# EAGLE design trackduino mini uc530 (EAGLE 7.1.0)
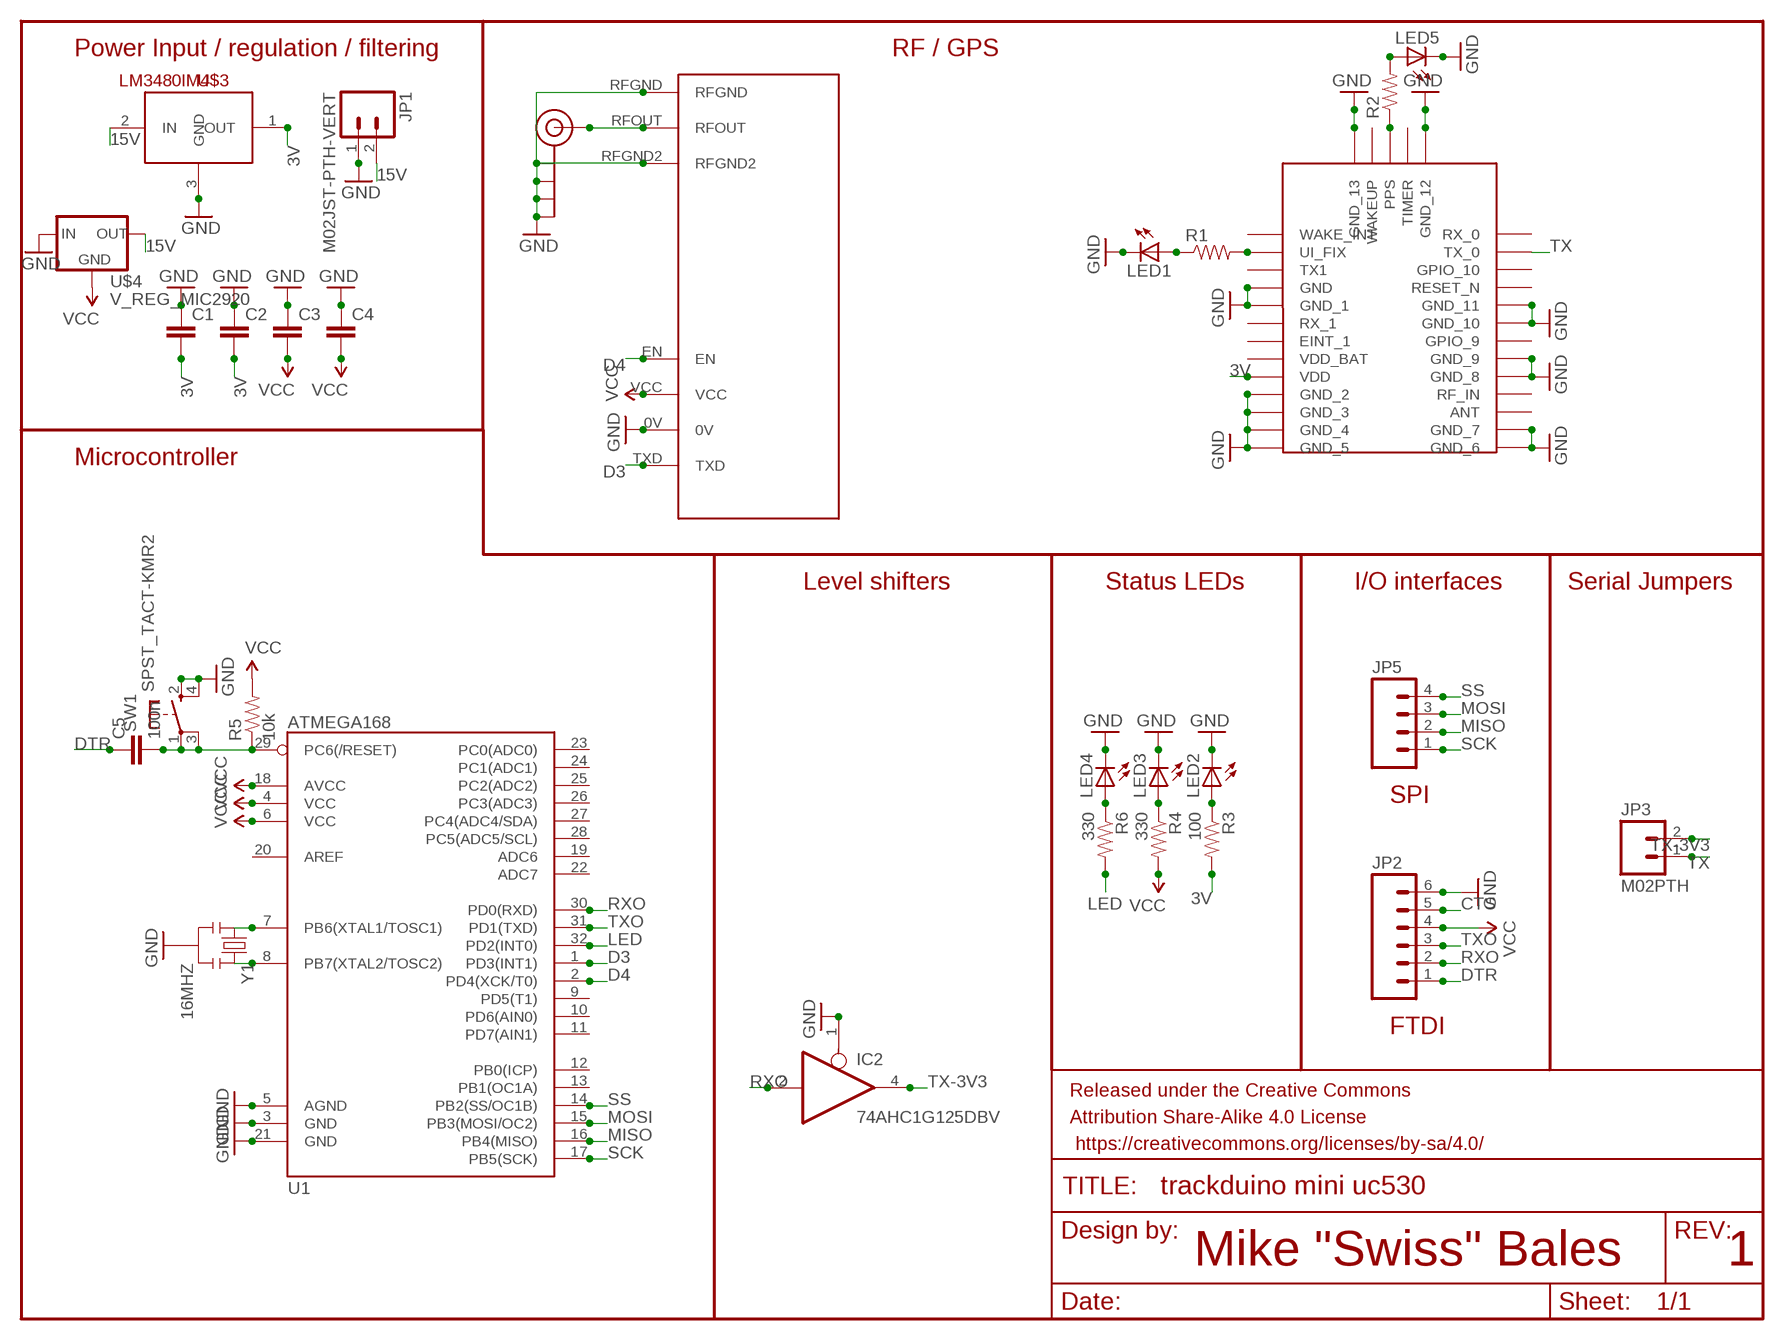
[diagram p0: schematic, sheet 1]

## Parts
C1  CAP0805  [0805]
C2  CAP0805  [0805]
C3  CAP0805  [0805]
C4  CAP0805  [0805]
C5  100n  CAP0805  [0805]
FRAME1  FRAME-LETTER  [CREATIVE_COMMONS]
IC2  74AHC1G125DBV  [SOT23-5]
J$1  SMA_EDGE  [SMA-EDGE]
JP1  M02JST-PTH-VERT  [JST-2-PTH-VERT]
JP2  M06NO_SILK_FEMALE_PTH  [1X06_NO_SILK]
JP3  M02PTH  [1X02]
JP5  M041X04_NO_SILK  [1X04_NO_SILK]
LED1  LEDCHIPLED_0805  [CHIPLED_0805]
LED2  LEDCHIP-LED0805  [CHIP-LED0805]
LED3  LEDCHIP-LED0805  [CHIP-LED0805]
LED4  LEDCHIP-LED0805  [CHIP-LED0805]
LED5  LEDCHIPLED_0805  [CHIPLED_0805]
R1  RESISTOR0805-RES  [0805]
R2  RESISTOR0805-RES  [0805]
R3  100  RESISTOR0805-RES  [0805]
R4  330  RESISTOR0805-RES  [0805]
R5  10k  RESISTOR0805-RES  [0805]
R6  330  RESISTOR0805-RES  [0805]
SW1  SPST_TACT-KMR2  [KMR2]
U1  ATMEGA168  [TQFP32-08]
U$1  UBLOXUC530  [UBLOXUC530]
U$2  RADIOMETRIX-HX1  [RADIOMETRIX-HX1]
U$3  LM3480IM4  [SOT23-3]
U$4  V_REG_MIC2920  [SOT223]
Y1  16MHZ  RESONATOR16MHZ  [RESONATOR-SMD]

## Nets
3V: C1.2 C2.2 R3.2 U$1.VDD U$3.1(OUT)
15V: JP1.2 U$3.2(IN) U$4.3(OUT)
CTS: JP2.5
D3: U1.1(PD3(INT1)) U$2.TXD
D4: U1.2(PD4(XCK/T0)) U$2.EN
DTR: C5.1 JP2.1
GND: C1.1 C2.1 C3.1 C4.1 IC2.1(OE) J$1.GND@0(GND) J$1.GND@1(GND) J$1.GND@2(GND) J$1.GND@3(GND) JP1.1 JP2.6 LED1.C LED2.C LED3.C LED4.C LED5.C SW1.2(S) SW1.4(S1) U1.3(GND) U1.5(AGND) U1.21(GND) U$1.GND U$1.GND_1 U$1.GND_2 U$1.GND_3 U$1.GND_4 U$1.GND_5 U$1.GND_6 U$1.GND_7 U$1.GND_8 U$1.GND_9 U$1.GND_10 U$1.GND_11 U$1.GND_12 U$1.GND_13 U$2.0V U$2.RFGND U$2.RFGND2 U$3.3(GND) U$4.1(IN) Y1.2
LED: R6.2 U1.32(PD2(INT0))
MISO: JP5.2 U1.16(PB4(MISO))
MOSI: JP5.3 U1.15(PB3(MOSI/OC2))
N$1: J$1.SIG(SIGNAL) U$2.RFOUT
N$7: LED2.A R3.1
N$8: LED3.A R4.1
N$9: C5.2 R5.1 SW1.1(P) SW1.3(P1) U1.29(PC6(/RESET))
N$14: U1.8(PB7(XTAL2/TOSC2)) Y1.3
N$26: U1.7(PB6(XTAL1/TOSC1)) Y1.1
N$27: LED4.A R6.1
N$33: R1.2 U$1.UI_FIX
N$34: R2.1 U$1.PPS
N$35: LED1.A R1.1
N$36: LED5.A R2.2
RXO: IC2.2(I) JP2.2 U1.30(PD0(RXD))
SCK: JP5.1 U1.17(PB5(SCK))
SS: JP5.4 U1.14(PB2(SS/OC1B))
TX: JP3.1 U$1.TX_0
TX-3V3: IC2.4(O) JP3.2
TXO: JP2.3 U1.31(PD1(TXD))
VCC: C3.2 C4.2 JP2.4 R4.2 R5.2 U1.4(VCC) U1.6(VCC) U1.18(AVCC) U$2.VCC U$4.2(GND)
Unconnected: U1.9(PD5(T1)) U1.10(PD6(AIN0)) U1.11(PD7(AIN1)) U1.12(PB0(ICP)) U1.13(PB1(OC1A)) U1.19(ADC6) U1.20(AREF) U1.22(ADC7) U1.23(PC0(ADC0)) U1.24(PC1(ADC1)) U1.25(PC2(ADC2)) U1.26(PC3(ADC3)) U1.27(PC4(ADC4/SDA)) U1.28(PC5(ADC5/SCL)) U$1.EINT_1 U$1.GPIO_9 U$1.GPIO_10 U$1.PANT(ANT) U$1.RESET_N U$1.RF_IN U$1.RX_0 U$1.RX_1 U$1.TIMER U$1.TX1 U$1.VDD_BAT U$1.WAKE_INT U$1.WAKEUP

## Notes on the sheet
- Power Input / regulation / filtering | RF / GPS
- Microcontroller
- Level shifters | Status LEDs | I/O interfaces | Serial Jumpers
- SPI
- FTDI
- Mike "Swiss" Bales | 1

## Power pins joined to a net without a drawn wire
GND: IC2.3(GND)
VCC: IC2.5(VCC)

## Library data of the parts
C1-C5 = SparkFun-Capacitors:CAP: Capacitor Standard 0603 ceramic capacitor, and 0.1" leaded capacitor.
FRAME1 = SparkFun-Aesthetics:FRAME-LETTER: Schematic Frame Standard 8.5x11 US Letter frame
IC2 = 74xx-little-us:74*1G125: Single Bus Buffer Gate with 3-State Output
J$1 = SparkFun-Connectors:SMA_EDGE: SMA Antenna Connector End launch SMA connector. The paste layer has been removed so that the connector can be hand soldered onto the board after reflow.
JP1 JP3 = SparkFun-Connectors:M02: Standard 2-pin 0.1" header. Use with - straight break away headers ( PRT-00116) - right angle break away headers (PRT-00553) - swiss pins (PRT-00743) - machine pins (PRT-00117) - female headers (PRT-00115) Molex polarized connector foot print use with: PRT-08233 with associated crimp pins and housings. 2.54_SCREWTERM for use with PRT-10571. 3.5mm Screw Terminal footprints for PRT-08084 5mm Screw Terminal footprints for use with PRT-08432
JP2 = SparkFun-Connectors:M06: Header 6 Standard 6-pin 0.1" header. Use with straight break away headers (SKU : PRT-00116), right angle break away headers (PRT-00553), swiss pins (PRT-00743), machine pins (PRT-00117), and female headers (PRT-00115). Molex polarized connector foot print use with SKU : PRT-08094 with associated crimp pins and housings. NOTES ON THE VARIANTS LOCK and LOCK_LONGPADS... This footprint was designed to help hold the alignment of a through-hole component (i.e. 6-pin header) while soldering it into place. You may notice that each hole has been shifted either up or down by 0.005 of an inch from it's more standard position (which is a perfectly straight line). This slight alteration caused the pins (the squares in the middle) to touch the edges of the holes. Because they are alternating, it causes a "brace" to hold the component in place. 0.005 has proven to be the perfect amount of "off-center" position when using our standard breakaway headers. Although looks a little odd when you look at the bare footprint, once you have a header in there, the alteration is very hard to notice. Also,if you push a header all the way into place, it is covered up entirely on the bottom side. This idea of altering the position of holes to aid alignment will be further integrated into the Sparkfun Library for other footprints. It can help hold any component with 3 or more connection pins.; PROD_ID: CONN-08437
JP5 = SparkFun-Connectors:M04: Header 4 Standard 4-pin 0.1" header. Use with straight break away headers (SKU : PRT-00116), right angle break away headers (PRT-00553), swiss pins (PRT-00743), machine pins (PRT-00117), and female headers (PRT-00115). Molex polarized connector foot print use with SKU : PRT-08231 with associated crimp pins and housings. 1MM SMD Version SKU: PRT-10208
LED1-LED5 = adafruit:LED: LED OSRAM: - CHIPLED LG R971, LG N971, LY N971, LG Q971, LY Q971, LO R971, LY R971 LH N974, LH R974 LS Q976, LO Q976, LY Q976 LO Q996 - Hyper CHIPLED LW Q18S LB Q993, LB Q99A, LB R99A - SideLED LS A670, LO A670, LY A670, LG A670, LP A670 LB A673, LV A673, LT A673, LW A673 LH A674 LY A675 LS A676, LA A676, LO A676, LY A676, LW A676 LS A679, LY A679, LG A679 - Hyper Micro SIDELED® LS Y876, LA Y876, LO Y876, LY Y876 LT Y87S - SmartLED LW L88C, LW L88S LB L89C, LB L89S, LG L890 LS L89K, LO L89K, LY L89K LS L896, LA L896, LO L896, LY L896 - TOPLED LS T670, LO T670, LY T670, LG T670, LP T670 LSG T670, LSP T670, LSY T670, LOP T670, LYG T670 LG T671, LOG T671, LSG T671 LB T673, LV T673, LT T673, LW T673 LH T674 LS T676, LA T676, LO T676, LY T676, LB T676, LH T676, LSB T676, LW T676 LB T67C, LV T67C, LT T67C, LS T67K, LO T67K, LY T67K, LW E67C LS E67B, LA E67B, LO E67B, LY E67B, LB E67C, LV E67C, LT E67C LW T67C LS T679, LY T679, LG T679 LS T770, LO T770, LY T770, LG T770, LP T770 LB T773, LV T773, LT T773, LW T773 LH T774 LS E675, LA E675, LY E675, LS T675 LS T776, LA T776, LO T776, LY T776, LB T776 LHGB T686 LT T68C, LB T68C - Hyper Mini TOPLED® LB M676 - Mini TOPLED Santana® LG M470 LS M47K, LO M47K, LY M47K Source: http://www.osram.convergy.de/
R1 R2 = SparkFun-Passives:RESISTOR: Resistor Basic schematic elements and footprints for 0603, 1206, and PTH resistors.
R3-R6 = SparkFun-Resistors:RESISTOR: Resistor Basic schematic elements and footprints for 0603, 1206, and PTH resistors.
SW1 = adafruit:SPST_TACT: SMT 6mm switch, EVQQ2 series http://www.ladyada.net/library/eagle
U1 = SparkFun-DigitalIC:ATMEGA168: Atmel 32-pin 8-bit micro, 16k flash.
U$1 = uc530:UBLOXUC530: Ublox 530m integrated GPS receiver and chip antenna
U$2 = Ava:RADIOMETRIX-HX1
U$3 = SparkFun-PowerIC:LM3480IM4: Small package linear regulator
U$4 = SparkFun-PowerIC:V_REG_MIC2920: MIC2920A (http://www.micrel.com/_PDF/mic2920.pdf) - 400mA output LDO Regulator
Y1 = SparkFun-FreqCtrl:RESONATOR: Resonator Small SMD resonator. Used, eg, on the Arduino Pro/ Pro Mini boards. 8MHz- XTAL-08895 16MHz- XTAL-08900; PROD_ID: XTAL-08900

## Board
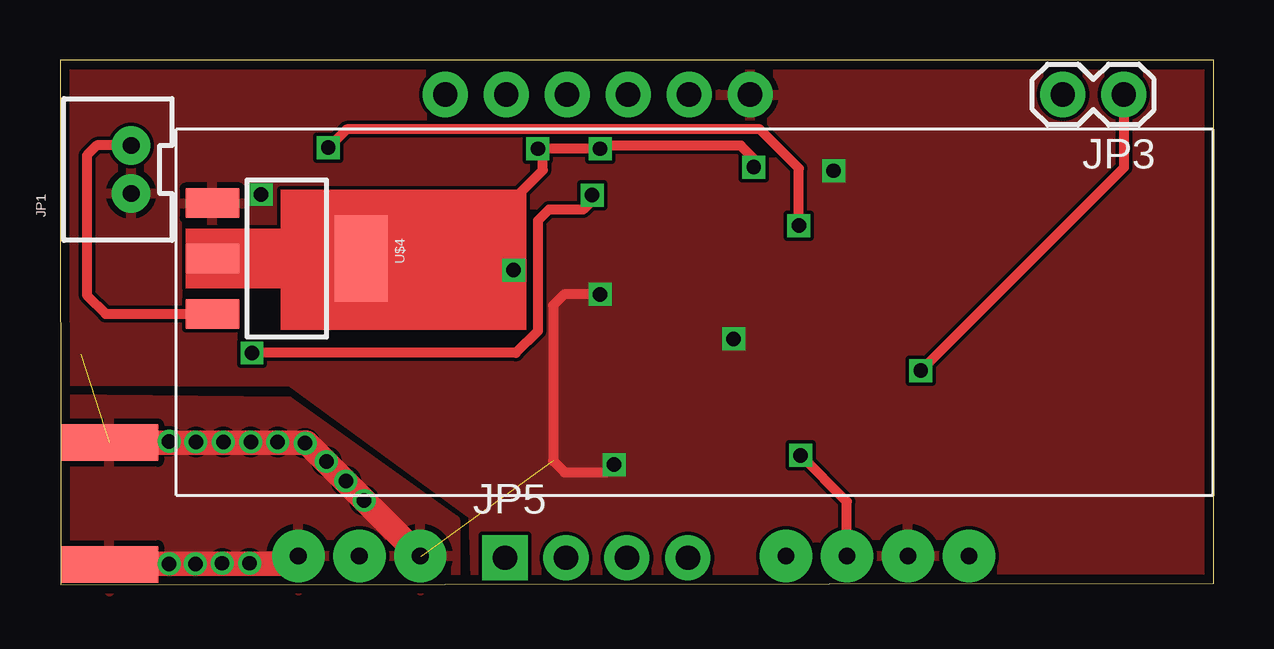
[diagram p1: board, top side]
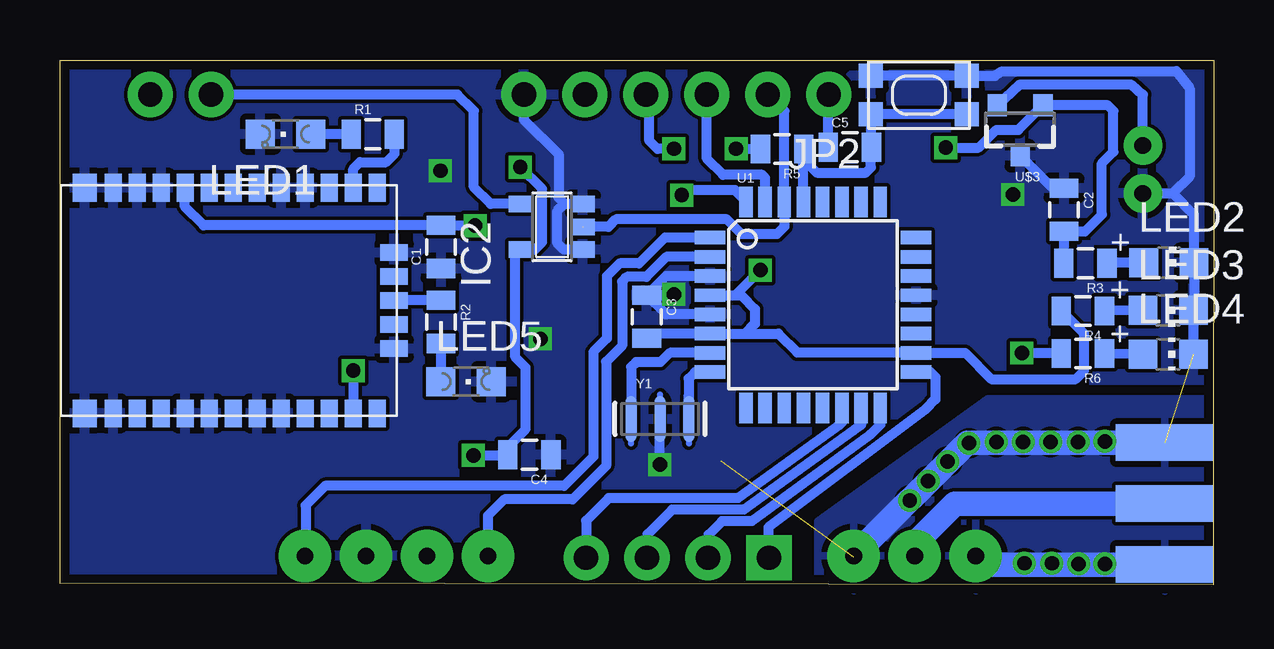
[diagram p2: board, bottom side, seen from below]

Size 48.08 x 21.86 mm. Coordinates in mm from the lower left corner, seen from the top.
Outline: 0.03,0 48.08,0.05 48.08,21.86 0,21.86 0.03,0
Copper layers (1*16): Top 0.0356mm / dielectric 1.5011mm / Bottom 0.0356mm
Design rules "OSHParkDRU": minimum track width 6mil, minimum drill 13mil, track to track 6mil, track to pad 6mil, pad to pad 6mil, via to via 6mil, smd to smd 6mil, copper to edge 15mil, drill to drill 6mil, minimum pad ring 7mil, minimum via ring 7mil, stop-mask expansion 3mil, vias tented up to drill 0mil, thermal gap 10mil

### Footprints (pad centres in the part's own frame; a part is rotated, then mirrored left to right if it is on the bottom)
0805 = smd 0.8 x 1.2: 1 -0.9,0; 2 0.9,0
SOT23-5 = smd 0.69 x 0.99: 1 -0.95,-1.29; 2 0,-1.29; 3 0.95,-1.29; 4 0.95,1.3; 5 -0.95,1.3
SMA-EDGE = smd 1.524 x 4.064: GND@0 0,0; GND@1 5.08,0; SIG 2.54,0 | smd 1.524 x 4.064 bottom: GND@2 0,0; GND@3 5.08,0
JST-2-PTH-VERT = drill 0.7 pad 1.6: 1 -1,-0.55; 2 1,-0.55
1X06_NO_SILK = drill 1.016 pad 1.88: 1 0,0; 2 2.54,0; 3 5.08,0; 4 7.62,0; 5 10.16,0; 6 12.7,0
1X02 = drill 1.016 pad 1.88: 1 0,0; 2 2.54,0
1X04_NO_SILK = drill 1.016 pad 1.88 square: 1 0,0 | drill 1.016 pad 1.88: 2 2.54,0; 3 5.08,0; 4 7.62,0
CHIPLED_0805 = smd 1.2 x 1.2: A 0,-1.05; C 0,1.05
CHIP-LED0805 = smd 1.2 x 1.2: A 0,-1.05; C 0,1.05
KMR2 = smd 1 x 1: 1 2,0.8; 2 2,-0.8; 3 -2,0.8; 4 -2,-0.8
TQFP32-08 = smd 1.27 x 0.559: 1 -4.293,2.8; 2 -4.293,2; 3 -4.293,1.2; 4 -4.293,0.4; 5 -4.293,-0.4; 6 -4.293,-1.2; 7 -4.293,-2; 8 -4.293,-2.8; 17 4.293,-2.8; 18 4.293,-2; 19 4.293,-1.2; 20 4.293,-0.4; 21 4.293,0.4; 22 4.293,1.2; 23 4.293,2; 24 4.293,2.8 | smd 0.559 x 1.27: 9 -2.8,-4.293; 10 -2,-4.293; 11 -1.2,-4.293; 12 -0.4,-4.293; 13 0.4,-4.293; 14 1.2,-4.293; 15 2,-4.293; 16 2.8,-4.293; 25 2.8,4.293; 26 2,4.293; 27 1.2,4.293; 28 0.4,4.293; 29 -0.4,4.293; 30 -1.2,4.293; 31 -2,4.293; 32 -2.8,4.293
UBLOXUC530 = smd 0.7 x 1.15: EINT_1 6.8,0.1; GND 3.8,0.1; GND_1 4.8,0.1; GND_2 9.8,0.1; GND_3 10.8,0.1; GND_4 11.8,0.1; GND_7 11.8,9.5; GND_8 8.8,9.5; GND_9 7.8,9.5; GND_10 5.8,9.5; GND_11 4.8,9.5; GPIO_9 6.8,9.5; GPIO_10 2.8,9.5; PANT 10.8,9.5; RESET_N 3.8,9.5; RF_IN 9.8,9.5; RX_0 0.8,9.5; RX_1 5.8,0.1; TX1 2.8,0.1; TX_0 1.8,9.5; UI_FIX 1.8,0.1; VDD 8.8,0.1; VDD_BAT 7.8,0.1; WAKE_INT 0.8,0.1 | smd 1 x 1.15: GND_5 13,0.1; GND_6 13,9.5 | smd 1.15 x 0.7: GND_12 0.1,6.8; GND_13 0.1,2.8; PPS 0.1,4.8; TIMER 0.1,5.8; WAKEUP 0.1,3.8
RADIOMETRIX-HX1 = drill 0.7 pad 2.184: 0V 8.89,-10.16; EN 3.81,-10.16; RFGND -11.43,-10.16; RFGND2 -16.51,-10.16; RFOUT -13.97,-10.16; TXD 11.43,-10.16; VCC 6.35,-10.16
SOT23-3 = smd 0.8 x 0.9: 1 -0.95,-1; 2 0.95,-1; 3 0,1.1
SOT223 = smd 1.219 x 2.235: 1 -2.311,-3.099; 2 0,-3.099; 3 2.311,-3.099 | smd 3.6 x 2.2: 4 0,3.099
RESONATOR-SMD = smd 0.45 x 1.905: 1 -1.2,0; 2 0,0; 3 1.2,0

### Placement (x,y rotation side)
C1  32.21,14.07 90 bottom
C2  6.25,15.62 270 bottom
C3  23.63,11.16 270 bottom
C4  28.52,5.41 180 bottom
C5  15.17,18.22 0 bottom
FRAME1  19.13,-8.1 0 top  (outside the outline)
IC2  27.58,14.91 90 bottom
J$1  2.06,0.84 90 bottom
JP1  2.41,17.3 90 top
JP2  16.05,20.42 180 bottom
JP3  44.32,20.42 180 top
JP5  18.54,1.12 0 top
LED1  38.68,18.77 90 bottom
LED2  1.88,13.41 270 bottom
LED3  1.91,11.43 270 bottom
LED4  1.91,9.6 270 bottom
LED5  31.17,8.46 270 bottom
R1  35.05,18.77 0 bottom
R2  32.21,10.95 270 bottom
R3  5.36,13.39 180 bottom
R4  5.46,11.4 180 bottom
R5  18,18.15 180 bottom
R6  5.46,9.63 180 bottom
SW1  12.29,20.4 180 bottom
U1  16.7,11.66 0 bottom
U$1  34.06,16.64 180 bottom
U$2  26.44,11.35 0 top
U$3  8.08,18.97 180 bottom
U$4  9.45,13.59 270 top
Y1  23.08,6.9 0 bottom

### Tracks (layer width: path | path; a pad name or v marks a point on that pad's centre or on a via)
3V  (via drill 0.6)
  Top 0.406: v30.78,14.96 30.78,17.35 29.16,18.97 11.94,18.97 v11.18,18.21
  Bottom 0.406: R3.2 6.23,14.66 C2.2 5.37,14.72 4.67,15.42 4.67,17.55 4.19,18.03 4.19,19.74 4.42,19.96 7.12,19.96 U$3.1 8.15,18.95 9.07,18.95 9.8,18.21 v11.18,18.21 | U$1.VDD 42.88,16.52 42.88,15.75 42.1,14.97 C1.2 v30.8,14.97 v30.78,14.96
15V
  Top 0.406: JP1.2 1.53,18.3 1.12,17.88 1.12,12.07 1.9,11.28 U$4.3
  Bottom 0.406: JP1.2 2.96,20.41 3.43,20.83 8.12,20.83 U$3.2
D3
  Bottom 0.406: U1.1 22.88,14.46 23.95,13.39 24.76,13.39 25.3,12.85 25.3,10.26 25.86,9.7 25.86,5.33 27.08,4.12 37.03,4.12 37.85,3.3 37.85,1.22 U$2.TXD
D4
  Bottom 0.406: U1.2 22.82,13.66 23.65,12.83 24.46,12.83 24.66,12.62 24.66,9.96 25.32,9.3 25.32,4.95 26.72,3.56 29.57,3.56 30.25,2.87 U$2.EN
DTR
  Bottom 0.406: C5.1 16.07,20.4 JP2.1
GND  (via drill 0.6)  (2 unrouted)
  Top 0.406: v22.5,12.09 21.01,12.09 20.55,11.63 20.55,5.16 21.03,4.67 22.76,4.67 v23.09,5
  Top 1.016: U$2.RFGND2 9.6,0.86 v5.64,0.86 v4.55,0.86 2.08,0.86 J$1.GND@2 | J$1.GND@1 10.29,5.92 15.04,1.17
  Bottom 0.406: JP1.1 1.72,16.3 | 1.72,16.3 0.84,15.42 0.84,13.42 LED2.C 0.83,12.01 LED3.C LED4.C | SW1.2 SW1.4 9.13,21.2 8.84,21.39 1.56,21.4 1.02,20.68 1.02,17 1.72,16.3 | 6.67,16.47 U$3.3 | 20.97,11.23 U1.5 22.83,11.26 C3.1 | IC2.1 27.09,13.96 27.36,14.22 27.36,15.57 27.05,15.88 | 27.05,15.88 26.31,15.88 IC2.3 | U1.3 22.83,12.86 C3.1 | JP2.6 28.75,19.38 27.3,17.93 27.3,16.13 27.05,15.88 | C3.1 22.53,12.06 v22.5,12.09 | v23.09,5 23.09,6.89 Y1.2
  Bottom 1.016: J$1.GND@1 10.29,5.92 U$2.RFGND | J$1.GND@2 9.58,0.84 U$2.RFGND2
  other vias: 28.07,10.24 32.23,17.25 8.38,16.26
  pour Top: 0,22.61 48.08,22.53 48.08,-0.46 17.35,-0.43 17.25,2.87 9.63,8.43 0.03,8.48
  pour Bottom: 0.03,22.56 48.06,22.5 48.06,-0.48 17.45,-0.43 17.3,-0.28 17.3,2.84 9.52,8.53 0,8.53
  pour Top: 0.05,7.75 9.52,7.65 16.46,2.69 16.46,-0.43 0.05,-0.33
  pour Bottom: -0.03,7.75 9.42,7.75 16.51,2.64 16.51,-0.41 0.08,-0.43
LED  (via drill 0.6)
  Top 0.406: v22.17,16.23 22.17,16 21.79,15.62 20.37,15.62 19.91,15.16 19.91,10.57 19,9.65 v8,9.65
  Bottom 0.406: U1.32 19.5,15.97 19.96,16.43 21.97,16.43 v22.17,16.23 | v8,9.65 6.39,9.65 R6.2
MISO
  Bottom 0.406: U1.16 13.9,6.67 14.33,6.25 19.25,2.64 20.5,2.64 21.06,2.08 21.06,1.14 JP5.2
MOSI
  Bottom 0.406: U1.15 14.7,6.66 15.01,6.43 19.58,3.12 22.58,3.12 23.6,2.11 23.6,1.14 JP5.3
N$1
  Bottom 1.016: J$1.SIG 10.79,3.38 12.47,1.7 U$2.RFOUT
N$7
  Bottom 0.406: LED2.A 4.43,13.41 R3.1
N$8
  Bottom 0.406: LED3.A R4.1
N$9
  Bottom 0.406: SW1.3 SW1.1 14.29,18.25 C5.2 14.3,18.19 14.3,17.37 14.5,17.17 16.56,17.17 17.1,17.71 R5.1 U1.29
N$12  (via drill 0.6)
  other vias: 4.55,5.97
N$13  (via drill 0.6)
  other vias: 5.66,5.94
N$14
  Bottom 0.406: U1.8 21.62,8.86 21.89,8.59 21.89,7.23 21.88,7.92
N$17  (via drill 0.6)
  other vias: 6.81,5.94
N$18  (via drill 0.6)
  other vias: 7.95,5.94
N$19  (via drill 0.6)
  other vias: 9.07,5.94
N$20  (via drill 0.6)
  other vias: 10.21,5.89
N$21  (via drill 0.6)
  other vias: 11.1,5.13
N$22  (via drill 0.6)
  other vias: 11.91,4.32
N$23  (via drill 0.6)
  other vias: 12.67,3.51
N$25  (via drill 0.6)
  other vias: 6.76,0.89
N$26
  Bottom 0.406: U1.7 22.68,9.66 23.06,9.27 24.08,9.27 24.28,9.07 Y1.1
N$27
  Bottom 0.406: LED4.A R6.1
N$28  (via drill 0.6)
  other vias: 7.9,0.89
N$33
  Bottom 0.406: U$1.UI_FIX 35.86,17.33 35.59,17.6 34.49,17.6 34.14,17.96 34.14,18.76 R1.2
N$34
  Bottom 0.406: R2.1 34.16,11.85 U$1.PPS
N$35
  Bottom 0.406: R1.1 LED1.A
N$36
  Bottom 0.406: LED5.A R2.2
RXO
  Bottom 0.406: JP2.2 17.9,19.73 U1.30 17.9,14.91 18.21,14.61 19.68,14.61 20.29,15.21 24.92,15.21 25.22,14.91 IC2.2
SCK
  Bottom 0.406: U1.17 11.8,8.86 11.61,8.66 11.61,7.72 12.01,7.32 18.57,2.39 JP5.1
SS
  Bottom 0.406: U1.14 15.5,6.75 15.6,6.66 19.84,3.61 25.22,3.61 26.16,2.67 JP5.4
TX  (via drill 0.6)
  Top 0.406: JP3.1 44.32,17.37 v35.86,8.92
  Bottom 0.406: v35.86,8.92 U$1.TX_0
TX-3V3
  Bottom 0.406: IC2.4 30.13,15.86 30.84,16.56 30.84,19.74 31.52,20.42 JP3.2
TXO
  Bottom 0.406: U1.31 18.7,16.95 18.82,17.07 20.45,17.07 21.13,17.75 JP2.3
VCC  (via drill 0.6)
  Top 0.406: v28.91,17.4 28.91,17.75 28.37,18.29 22.63,18.29 v22.5,18.16 v19.91,18.16 20.12,17.96 20.12,17.27 18.9,16.05 v18.9,13.11 18.41,13.59 U$4.2 | U$2.VCC 32.79,3.45 v30.86,5.39
  Bottom 0.406: 19.53,10.46 U1.6 23.43,10.46 C3.2 | 19.53,10.46 18.15,10.46 17.37,9.68 12.43,9.68 U1.18 10.37,9.66 9.27,8.56 5.77,8.56 5.41,8.92 5.41,10.45 R4.2 | v18.9,13.11 19.95,12.06 U1.4 19.7,12.06 19.13,11.48 19.13,10.86 19.53,10.46 | v19.91,18.16 18.91,18.16 R5.2 | v22.5,18.16 23.19,18.16 23.52,18.49 23.52,20.27 JP2.4 | v28.91,17.4 27.99,16.48 27.99,14.28 28.31,13.96 IC2.5 29.11,13.74 29.11,9.47 28.68,9.04 28.68,6.48 29.42,5.73 C4.2 29.62,5.41 29.64,5.39 v30.86,5.39
(copper drawn outside any net)
  shapes: Top area x2